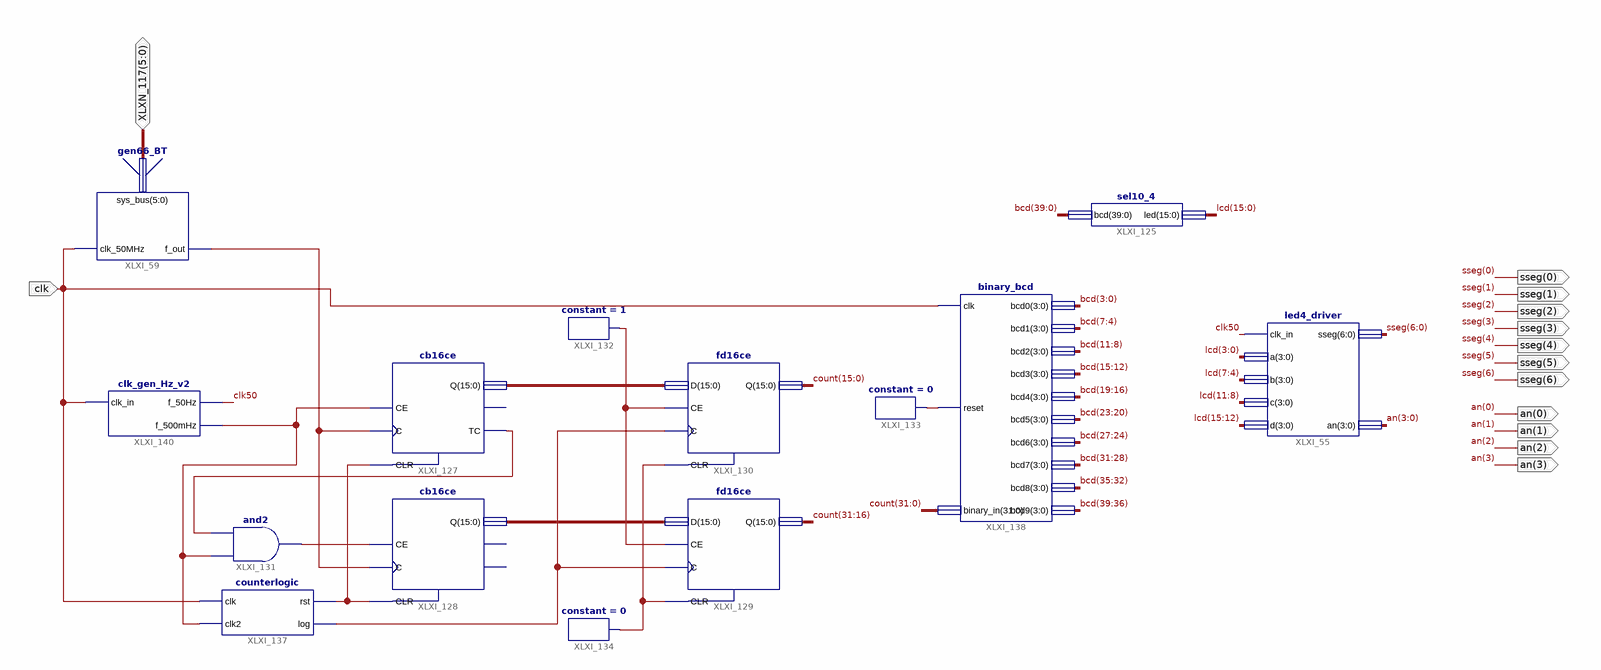
[diagram p0: schematic sheet 1]
// Xilinx ISE schematic czestotliwosci.sch (spartan3e) as structural Verilog: 14 symbols, 13 ports
module czestotliwosci (
  input  clk,
  inout  [5:0] XLXN_117,
  output [6:0] sseg,
  output [3:0] an
);

  wire clk50, XLXN_322, XLXN_323, XLXN_324, XLXN_326, XLXN_343, XLXN_344, XLXN_345, XLXN_349, XLXN_355;
  wire [15:0] lcd, XLXN_318, XLXN_319;
  wire [31:0] count;
  wire [39:0] bcd;

  led4_driver XLXI_55 (.clk_in(clk50), .a(lcd[3:0]), .b(lcd[7:4]), .c(lcd[11:8]), .d(lcd[15:12]), .sseg(sseg), .an(an));
  gen66_BT #(.pmodName("JC")) XLXI_59 (.clk_50MHz(clk), .sys_bus(XLXN_117), .f_out(XLXN_322));
  sel10_4 XLXI_125 (.bcd(bcd), .led(lcd));
  cb16ce XLXI_127 (.C(XLXN_322), .CE(XLXN_326), .CLR(XLXN_355), .Q(XLXN_318), .TC(XLXN_324));  // open: CEO
  cb16ce XLXI_128 (.C(XLXN_322), .CE(XLXN_323), .CLR(XLXN_355), .Q(XLXN_319));  // open: CEO, TC
  fd16ce XLXI_129 (.C(XLXN_349), .CE(XLXN_344), .CLR(XLXN_343), .D(XLXN_319), .Q(count[31:16]));
  fd16ce XLXI_130 (.C(XLXN_349), .CE(XLXN_344), .CLR(XLXN_343), .D(XLXN_318), .Q(count[15:0]));
  and XLXI_131 (XLXN_323, XLXN_326, XLXN_324);
  constant #(.CValue("1")) XLXI_132 (.O(XLXN_344));
  constant #(.CValue("0")) XLXI_133 (.O(XLXN_345));
  constant #(.CValue("0")) XLXI_134 (.O(XLXN_343));
  counterlogic XLXI_137 (.clk(clk), .clk2(XLXN_326), .rst(XLXN_355), .log(XLXN_349));
  binary_bcd XLXI_138 (
    .clk(clk), .reset(XLXN_345), .binary_in(count), .bcd0(bcd[3:0]), .bcd1(bcd[7:4]), .bcd2(bcd[11:8]),
    .bcd3(bcd[15:12]), .bcd4(bcd[19:16]), .bcd5(bcd[23:20]), .bcd6(bcd[27:24]), .bcd7(bcd[31:28]),
    .bcd8(bcd[35:32]), .bcd9(bcd[39:36]));
  clk_gen_Hz_v2 XLXI_140 (.clk_in(clk), .f_50Hz(clk50), .f_500mHz(XLXN_326));

  // Notes on the sheet:
  //   LOC on signal sseg(0) = L18
  //   LOC on signal sseg(1) = F18
  //   LOC on signal sseg(2) = D17
  //   LOC on signal sseg(3) = D16
  //   LOC on signal sseg(4) = G14
  //   LOC on signal sseg(5) = J17
  //   LOC on signal sseg(6) = H14
  //   LOC on signal an(0) = F17
  //   LOC on signal an(1) = H17
  //   LOC on signal an(2) = C18
  //   LOC on signal an(3) = F15
  //   LOC on signal clk = B8
endmodule
